# Altium schematic sheet Sheet1.SchDoc
size A2
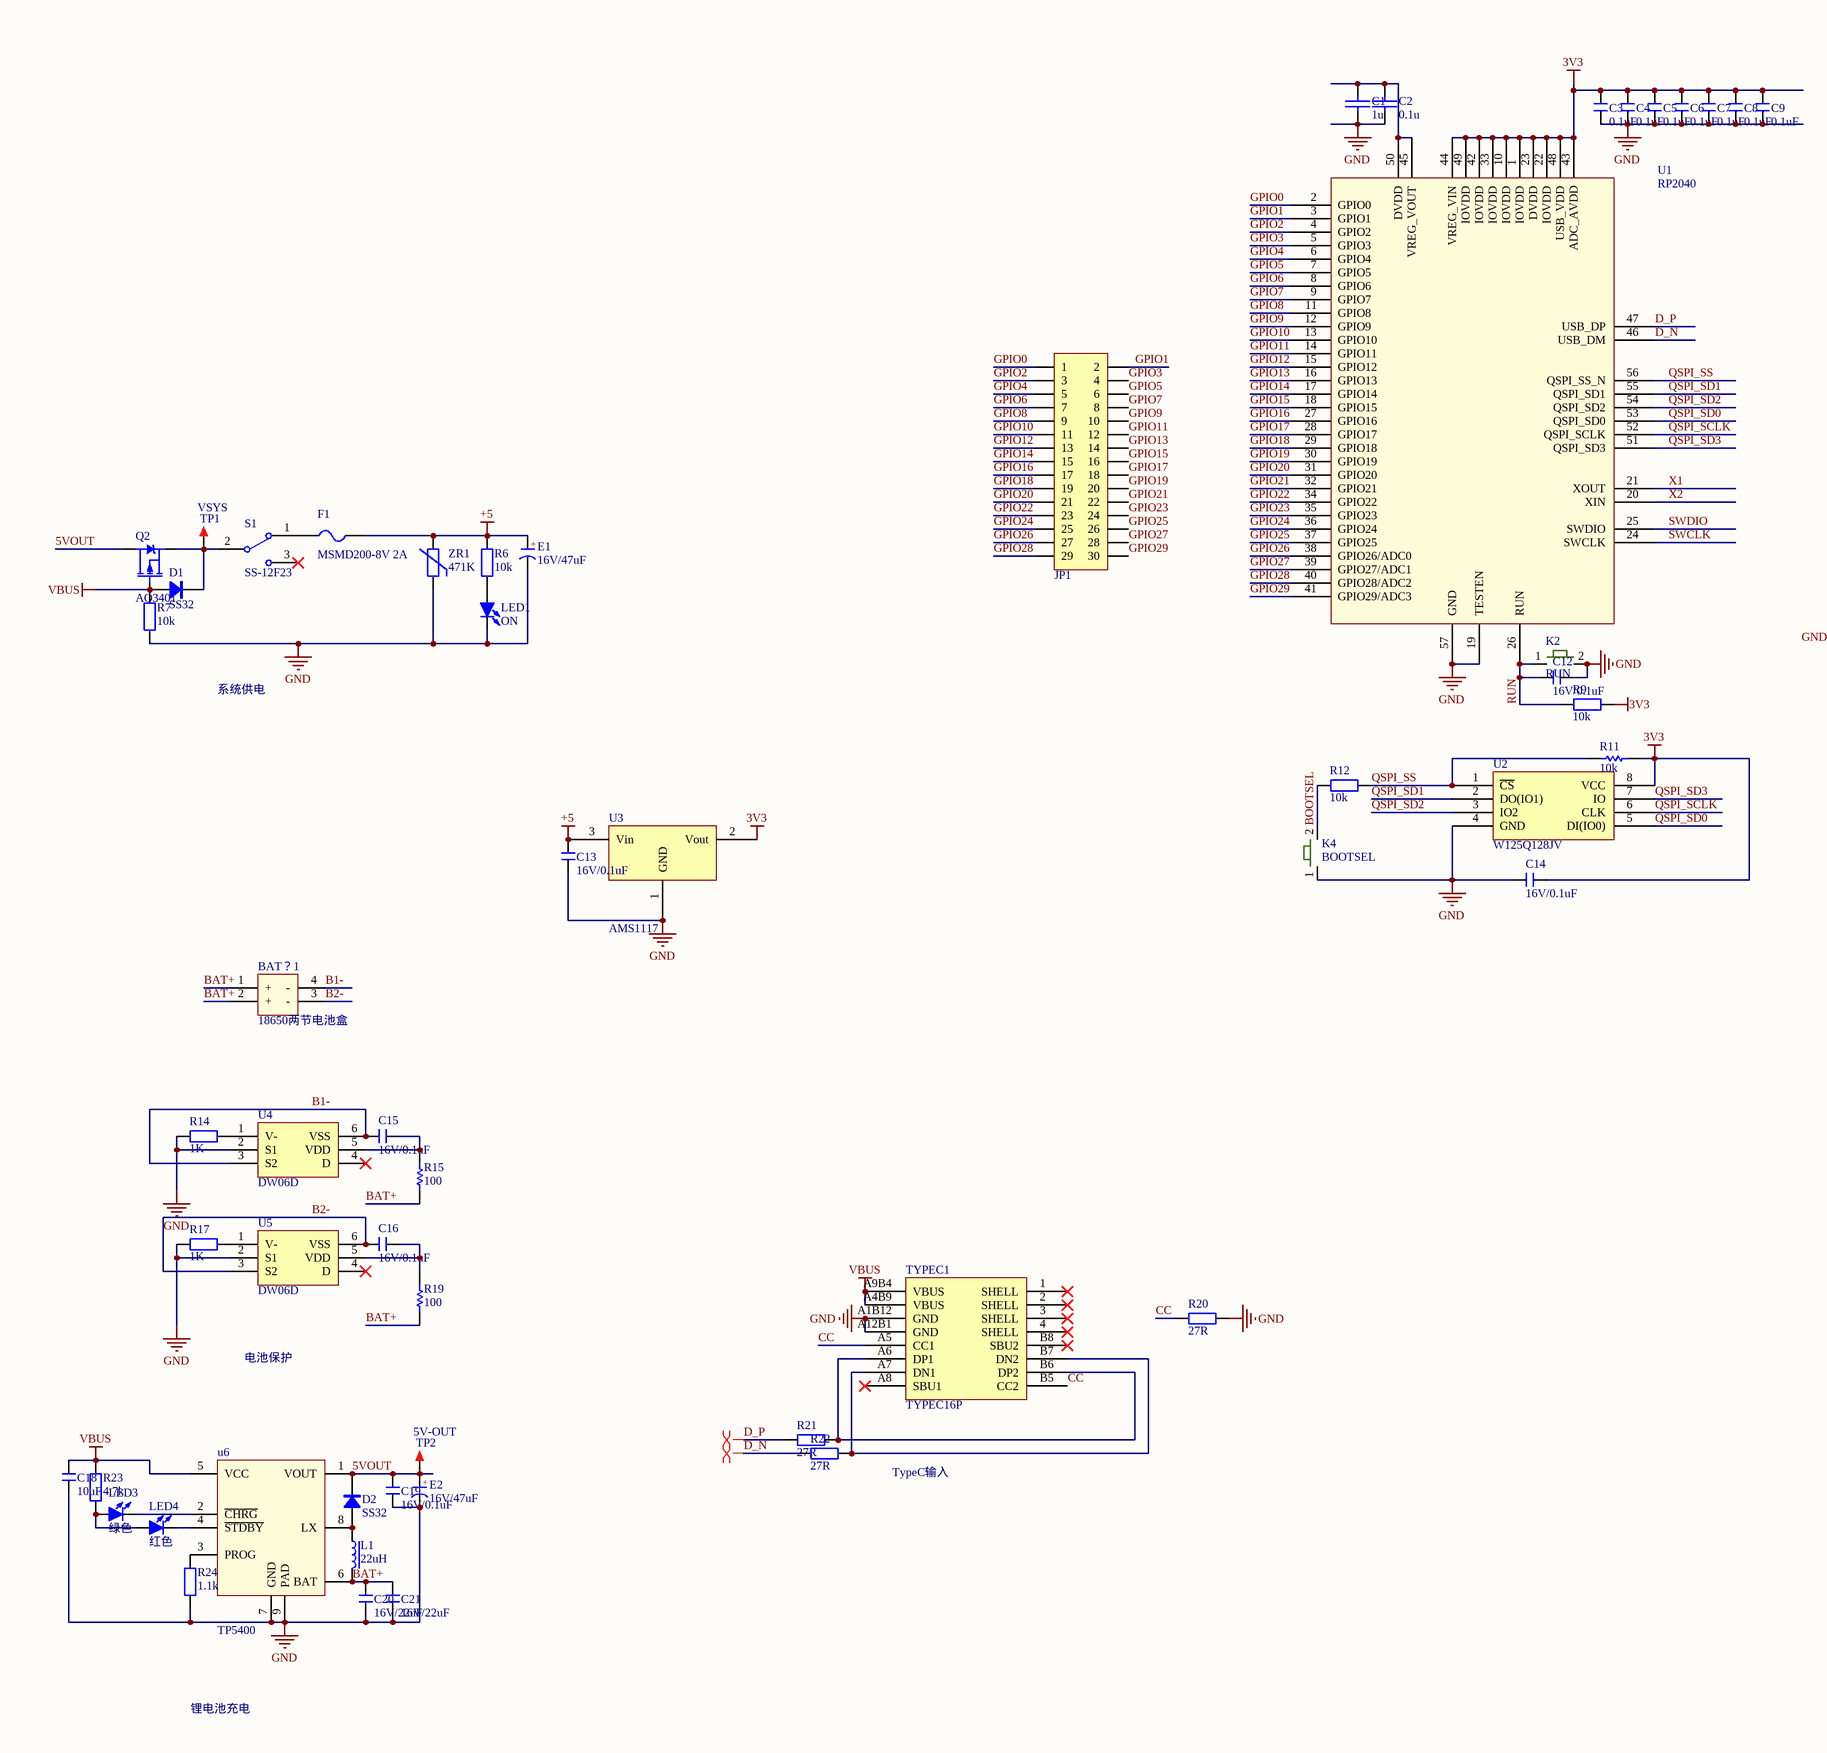
[diagram p0: Sheet1.SchDoc, left]
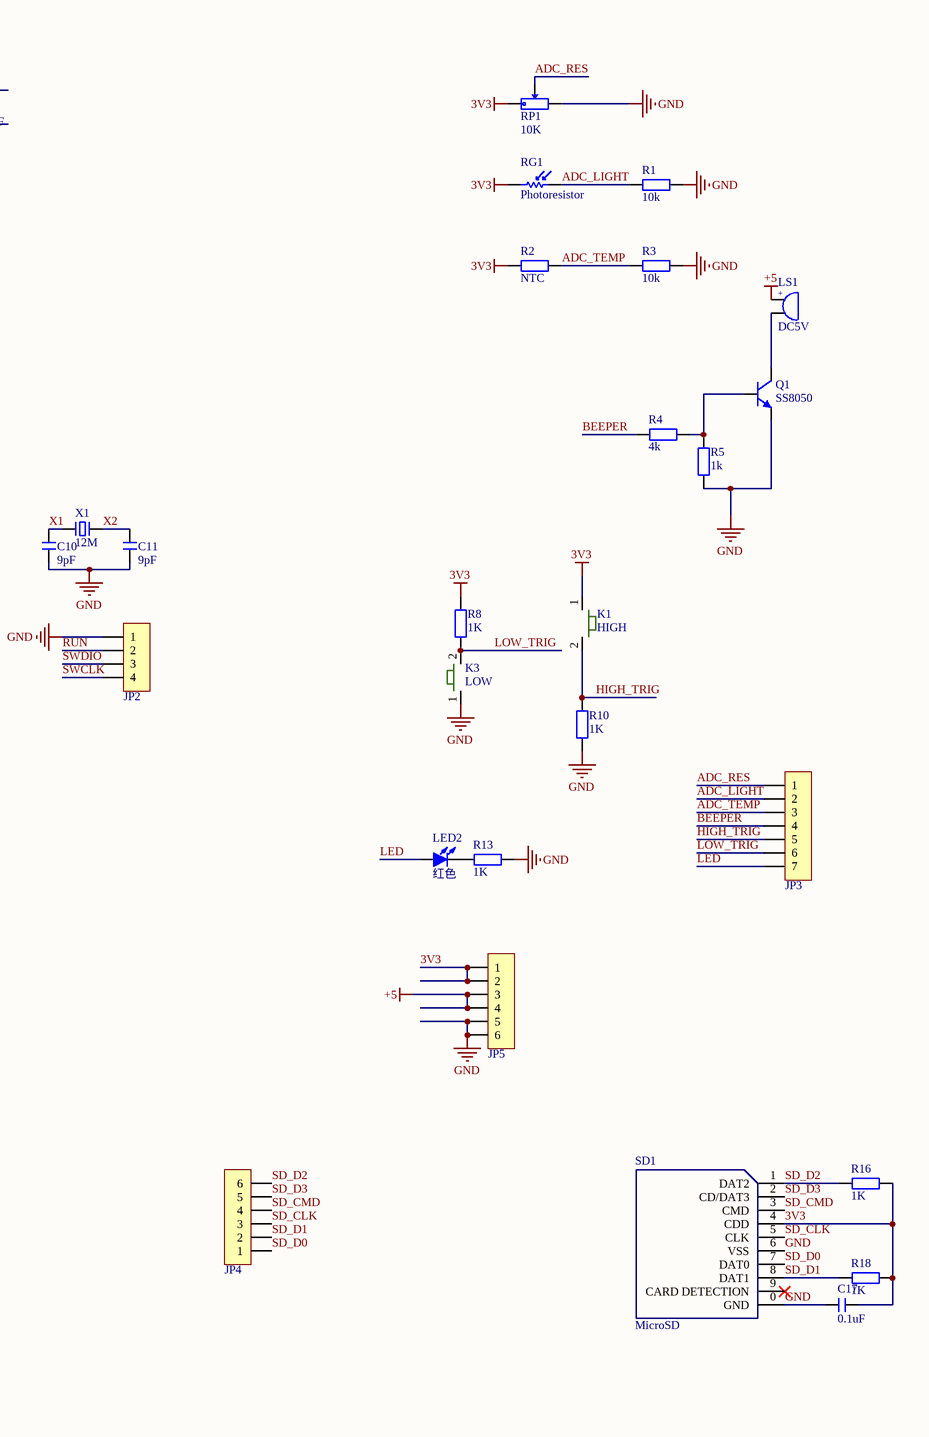
[diagram p1: Sheet1.SchDoc, right]

## Parts
BAT？1  18650两节电池盒  [18650两节电池盒]
C1  1u  [C 0603_L]
C2  0.1u  [C 0603_L]
C3  0.1uF  [C 0603_L]
C4  0.1uF  [C 0603_L]
C5  0.1uF  [C 0603_L]
C6  0.1uF  [C 0603_L]
C7  0.1uF  [C 0603_L]
C8  0.1uF  [C 0603_L]
C9  0.1uF  [C 0603_L]
C10  9pF  [C 0603_L]
C11  9pF  [C 0603_L]
C12  16V/0.1uF  [C 0603_L]
C13  16V/0.1uF  [C 0603_L]
C14  16V/0.1uF  [C 0603_L]
C15  16V/0.1uF  [C 0603_L]
C16  16V/0.1uF  [C 0603_L]
C17  0.1uF  [C 0603_L]
C18  10uF  [C 0603_L]
C19  16V/0.1uF  [C 0603_L]
C20  16V/22uF  [C 0603_L]
C21  16V/22uF  [C 0603_L]
D1  SS32  [SMA]
D2  SS32  [SMA]
E1  16V/47uF  [CM C(5*5.4)]
E2  16V/47uF  [CM C(5*5.4)]
F1  MSMD200-8V 2A  [FU 1206]
JP1  Header 2X11  [HDR2.54-LI-2x15P]  (value not drawn)
JP2  DEBUG  [HDR2.54-LI-4P]  (value not drawn)
JP3  HDR-1X7  [HDR2.54-LI-7P]  (value not drawn)
JP4  HDR-1X6  [HDR2.54-LI-6P]  (value not drawn)
JP5  HDR-1X6  [HDR2.54-LI-6P]  (value not drawn)
K1  HIGH  [轻触按键]
K2  RUN  [轻触按键]
K3  LOW  [轻触按键]
K4  BOOTSEL  [轻触按键]
L1  22uH  [NR4020]
LED1  ON  [LED 0603R]
LED2  红色  [LED 0603R]
LED3  绿色  [LED 0603G]
LED4  红色  [LED 0603R]
LS1  DC5V  [BUZZER-7525]
Q1  SS8050  [SOT-23]
Q2  AO3401  [SOT23]
R1  10k  [R 0603_L]
R2  NTC  [R 0603_L]
R3  10k  [R 0603_L]
R4  4k  [R 0603_L]
R5  1k  [R 0603_L]
R6  10k  [R 0603_L]
R7  10k  [R 0603_L]
R8  1K  [R 0603_L]
R9  10k  [R 0603_L]
R10  1K  [R 0603_L]
R11  10k  [R 0603_L]
R12  10k  [R 0603_L]
R13  1K  [R 0603_L]
R14  1K  [R 0603_L]
R15  100  [R 0603_L]
R16  1K  [R 0603_L]
R17  1K  [R 0603_L]
R18  1K  [R 0603_L]
R19  100  [R 0603_L]
R20  27R  [R 0603_L]
R21  27R  [R 0603_L]
R22  27R  [R 0603_L]
R23  4.7k  [R 0603_L]
R24  1.1k  [R 0603_L]
RG1  Photoresistor  [Photoresistor]
RP1  10K  [拨盘电位器]
S1  SS-12F23  [SK-12D07VG3]
SD1  MicroSD  [Micro SD]
TP1  VSYS  [TEST 1]
TP2  5V-OUT  [TEST 1]
TYPEC1  TYPEC16P  [TYPEC-16P]
U1  RP2040  [QFN-56]
U2  W125Q128JV  [SOIC-8-208mil]
U3  AMS1117  [SOT89]
U4  DW06D  [SOT23-6]
U5  DW06D  [SOT23-6]
u6  TP5400  [ESOP8]
X1  12M  [OSC HC-49SMD]
ZR1  471K  [R 0603_L]

## Nets
3V3: C3.2 C4.2 C5.2 C6.2 C7.2 C8.2 C9.2 C14.1 C17.1 JP5.1 JP5.2 K1.1 R2.1 R8.2 R9.1 R11.2 R16.2 R18.2 RG1.1 RP1.1 SD1.4(CDD) U1.1(IOVDD) U1.10(IOVDD) U1.22(IOVDD) U1.23(DVDD) U1.33(IOVDD) U1.42(IOVDD) U1.43(ADC_AVDD) U1.44(VREG_VIN) U1.48(USB_VDD) U1.49(IOVDD) U2.8(VCC) U3.2(Vout)
+5: C13.2 E1.1(A) F1.2 JP5.3 JP5.4 LS1.1 R6.2 U3.3(Vin) ZR1.2
GND: C1.1 C2.1 C3.1 C4.1 C5.1 C6.1 C7.1 C8.1 C9.1 C10.1 C11.1 C12.1 C13.1 C14.2 C17.2 C18.1 C19.1 C20.1 C21.1 E1.2(K) E2.2(K) JP2.1 JP5.5 JP5.6 K2.2 K3.1 K4.1 LED1.2(K) Q1.2(E) R1.1 R3.1 R5.1 R7.1 R10.1 R13.1 R14.1 R17.1 R20.2 R24.1 RP1.3 SD1.0(GND) SD1.6(VSS) TYPEC1.A1B12(GND) TYPEC1.A12B1(GND) U1.19(TESTEN) U1.57(GND) U2.4(GND) U3.1(GND) U4.2(S1) U5.2(S1) u6.7(GND) u6.9(PAD) ZR1.1
VBUS: C18.2 D1.1(A) Q2.G R7.2 R23.2 TYPEC1.A4B9(VBUS) TYPEC1.A9B4(VBUS) u6.5(VCC)
5VOUT: C19.2 D2.2(K) E2.1(A) Q2.D TP2.1 u6.1(VOUT)
ADC_LIGHT: JP3.2 R1.2 RG1.2
ADC_RES: JP3.1 RP1.2
ADC_TEMP: JP3.3 R2.2 R3.2
B1-: BAT？1.4(-) C15.2 U4.3(S2) U4.6(VSS)
B2-: BAT？1.3(-) C16.2 U5.3(S2) U5.6(VSS)
BAT+: BAT？1.1(+) BAT？1.2(+) C20.2 C21.2 L1.2 R15.2 R19.2 u6.6(BAT)
BEEPER: JP3.4 R4.1
BOOTSEL: K4.2 R12.2
CC: R20.1 TYPEC1.A5(CC1) TYPEC1.B5(CC2)
D_N: R22.1 U1.46(USB_DM)
D_P: R21.1 U1.47(USB_DP)
GPIO0: JP1.1 U1.2(GPIO0)
GPIO1: JP1.2 U1.3(GPIO1)
GPIO2: JP1.3 U1.4(GPIO2)
GPIO3: JP1.4 U1.5(GPIO3)
GPIO4: JP1.5 U1.6(GPIO4)
GPIO5: JP1.6 U1.7(GPIO5)
GPIO6: JP1.7 U1.8(GPIO6)
GPIO7: JP1.8 U1.9(GPIO7)
GPIO8: JP1.9 U1.11(GPIO8)
GPIO9: JP1.10 U1.12(GPIO9)
GPIO10: JP1.11 U1.13(GPIO10)
GPIO11: JP1.12 U1.14(GPIO11)
GPIO12: JP1.13 U1.15(GPIO12)
GPIO13: JP1.14 U1.16(GPIO13)
GPIO14: JP1.15 U1.17(GPIO14)
GPIO15: JP1.16 U1.18(GPIO15)
GPIO16: JP1.17 U1.27(GPIO16)
GPIO17: JP1.18 U1.28(GPIO17)
GPIO18: JP1.19 U1.29(GPIO18)
GPIO19: JP1.20 U1.30(GPIO19)
GPIO20: JP1.21 U1.31(GPIO20)
GPIO21: JP1.22 U1.32(GPIO21)
GPIO22: JP1.23 U1.34(GPIO22)
GPIO23: JP1.24 U1.35(GPIO23)
GPIO24: JP1.25 U1.36(GPIO24)
GPIO25: JP1.26 U1.37(GPIO25)
GPIO26: JP1.27 U1.38(GPIO26/ADC0)
GPIO27: JP1.28 U1.39(GPIO27/ADC1)
GPIO28: JP1.29 U1.40(GPIO28/ADC2)
GPIO29: JP1.30 U1.41(GPIO29/ADC3)
HIGH_TRIG: JP3.5 K1.2 R10.2
LED: JP3.7 LED2.1(A)
LOW_TRIG: JP3.6 K3.2 R8.1
QSPI_SCLK: U1.52(QSPI_SCLK) U2.6(CLK)
QSPI_SD0: U1.53(QSPI_SD0) U2.5(DI(IO0))
QSPI_SD1: U1.55(QSPI_SD1) U2.2(DO(IO1))
QSPI_SD2: U1.54(QSPI_SD2) U2.3(IO2)
QSPI_SD3: U1.51(QSPI_SD3) U2.7(IO)
QSPI_SS: R11.1 R12.1 U1.56(QSPI_SS_N) U2.1(~{CS})
RUN: C12.2 JP2.2 K2.1 R9.2 U1.26(RUN)
SD_CLK: JP4.3 SD1.5(CLK)
SD_CMD: JP4.4 SD1.3(CMD)
SD_D0: JP4.1 SD1.7(DAT0)
SD_D1: JP4.2 R18.1 SD1.8(DAT1)
SD_D2: JP4.6 R16.1 SD1.1(DAT2)
SD_D3: JP4.5 SD1.2(CD/DAT3)
SWCLK: JP2.4 U1.24(SWCLK)
SWDIO: JP2.3 U1.25(SWDIO)
X1: C10.2 U1.21(XOUT) X1.1
X2: C11.2 U1.20(XIN) X1.2
NetC1_2: C1.2 C2.2 U1.45(VREG_VOUT) U1.50(DVDD)
NetC15_1: C15.1 R15.1 U4.5(VDD)
NetC16_1: C16.1 R19.1 U5.5(VDD)
NetD1_2: D1.2(K) Q2.S S1.2 TP1.1
NetD2_1: D2.1(A) L1.1 u6.8(LX)
NetF1_1: F1.1 S1.1
NetLED1_1: LED1.1(A) R6.1
NetLED2_2: LED2.2(K) R13.2
NetLED3_1: LED3.1(A) LED4.1(A) R23.1
NetLED3_2: LED3.2(K) u6.2(~{CHRG})
NetLED4_2: LED4.2(K) u6.4(~{STDBY})
NetLS1_2: LS1.2 Q1.3(C)
NetQ1_1: Q1.1(B) R4.2 R5.2
NetR14_2: R14.2 U4.1(V-)
NetR17_2: R17.2 U5.1(V-)
NetR21_2: R21.2 TYPEC1.A6(DP1) TYPEC1.B6(DP2)
NetR22_2: R22.2 TYPEC1.A7(DN1) TYPEC1.B7(DN2)
NetR24_2: R24.2 u6.3(PROG)

Not connected (* = marked no-connect by the designer): S1 3*; SD1 9(CARD_DETECTION)*; TYPEC1 1(SHELL)* 2(SHELL)* 3(SHELL)* 4(SHELL)* A8(SBU1)* B8(SBU2)*; U4 4(D)*; U5 4(D)*

## Layout directives
differential pair: D_N, D_P

## Notes on the sheet
- 系统供电
- 电池保护
- TypeC输入
- 锂电池充电
- (in symbol BEEP) +
- (in symbol C-CM) +

## Library data of the parts
C1 = CAP: 靠近RP2040
C2 = CAP: 无极性电容
C3-C21 = C: 无极性贴片电容; 版权归属: 源创客; 材质: X7R; BOM名称: 无极性贴片电容; 学习资源: www.ooocke.com
D1 D2 = SS210: 肖特基二极管; 版权归属: 源创客; BOM名称: 肖特基二极管; 学习资源: www.ooocke.com
E1 E2 = C-CM: 贴片电解电容; 版权归属: 源创客; BOM名称: 贴片电解电容; 学习资源: www.ooocke.com
F1 = FU: 贴片保险丝; 版权归属: 源创客; BOM名称: 贴片保险丝; 学习资源: www.ooocke.com
JP1 = Header 15X2: 15*2P接插件; 版权归属: 源创客; BOM名称: 15*2P接插件; 学习资源: www.ooocke.com
JP2 = Header 4: 4P接插件; 版权归属: 源创客; BOM名称: 4P接插件; 学习资源: www.ooocke.com
JP3 = Header 7: 7P接插件; 版权归属: 源创客; BOM名称: 7P接插件; 学习资源: www.ooocke.com
JP4 JP5 = Header 6: 6P接插件; 版权归属: 源创客; BOM名称: 6P接插件; 学习资源: www.ooocke.com
K1-K4 = 两脚轻触开关
L1 = L-NR: NR磁胶电感; 版权归属: 源创客; BOM名称: NR磁胶电感; 学习资源: www.ooocke.com
LED1-LED4 = LED-SMD: 贴片LED; 版权归属: 源创客; BOM名称: 贴片LED; 学习资源: www.ooocke.com
LS1 = BEEP: 蜂鸣器; 版权归属: 源创客; BOM名称: 蜂鸣器; 学习资源: www.ooocke.com
Q1 = 8050-SMD: 高频放大-NPN型; 版权归属: 源创客; 属性: 40V 1.5A 1W 100MHZ; BOM名称: 高频放大-NPN型; 学习资源: www.ooocke.com
Q2 = P-MOS: P沟道场效应管
R1-R10 R12-R14 R16-R18 R20-R24 = R: 贴片电阻; 版权归属: 源创客; BOM名称: 贴片电阻; 学习资源: www.ooocke.com
R11 R15 R19 = RES
RG1 = Photoresistor: 光敏电阻
RP1 = RP-SMD: 贴片电位器; 版权归属: 源创客; BOM名称: 贴片电位器; 学习资源: www.ooocke.com
S1 = SSW-1P: 1路波动开关; BOM名称: 波动开关; 版权归属: 源创客; 学习资源: www.ooocke.com
TP1 TP2 = TEST: 测试点; 版权归属: 源创客; BOM名称: 测试点; 学习资源: www.ooocke.com
U3 = AMS1117: 三端稳压芯片
X1 = XTAL-2P: 2脚无源脚晶振
ZR1 = R_VDR: 压敏电阻; 版权归属: 源创客; BOM名称: 压敏电阻; 学习资源: www.ooocke.com